# EAGLE schematic BMS_Master (EAGLE 6.6.0)

## Sheet 1 of 6: Supply
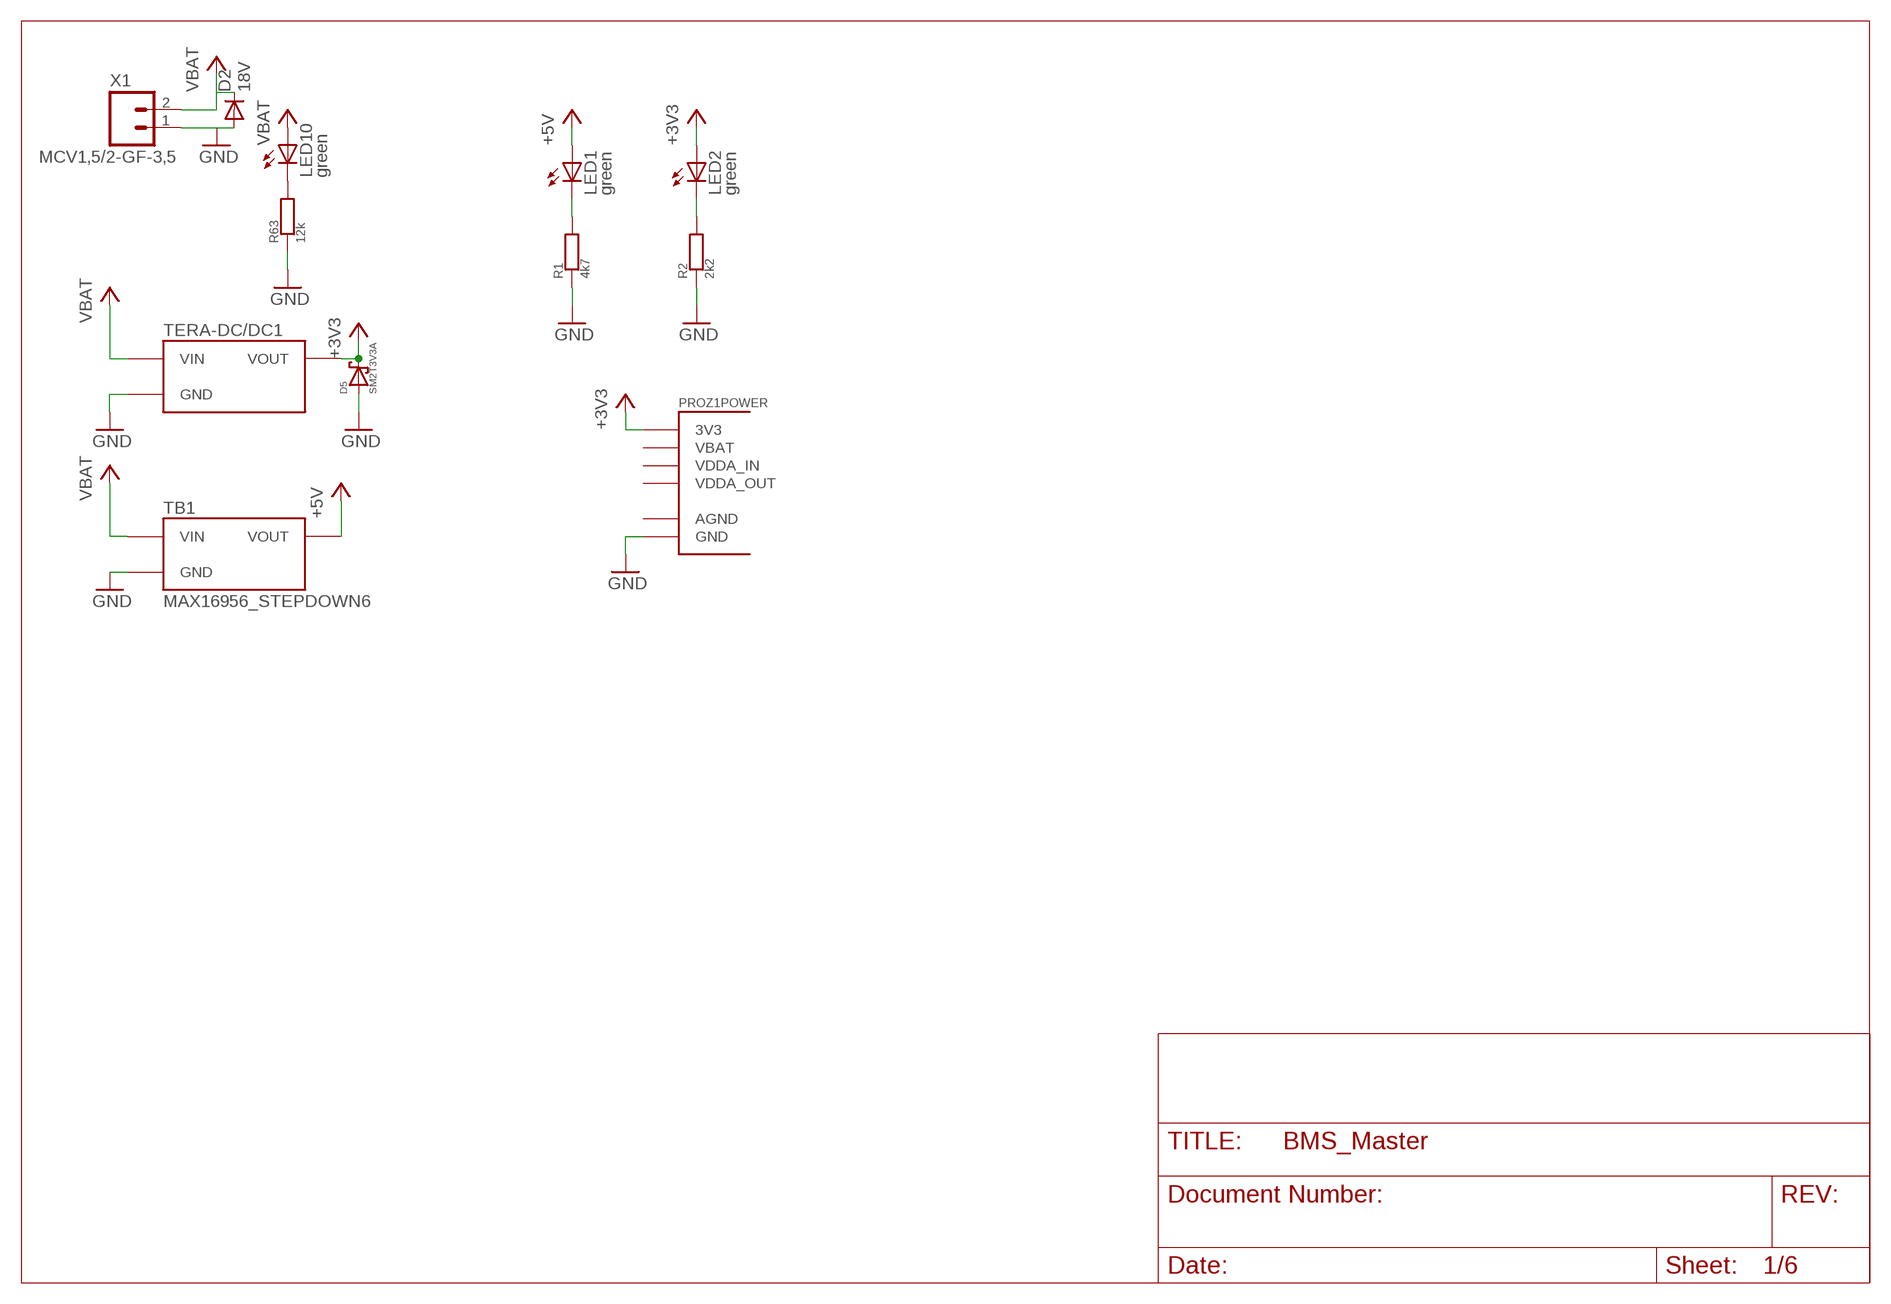
[diagram p0: schematic, sheet 1]

### Parts
D2  18V  DIODE-DO214AA  [DO214AA]
D5  SM2T3V3A  [SM2T3V3A]
LED1  green  LEDCHIP-LED0805  [CHIP-LED0805]
LED2  green  LEDCHIP-LED0805  [CHIP-LED0805]
LED10  green  LEDCHIP-LED0805  [CHIP-LED0805]
PROZ1  STM32F4_PROZESSORBOARDRPZ  [STM32F4_PROZESSORBOARD]
R1  4k7  R  [R0805]
R2  2k2  R  [R0805]
R63  12k  R  [R0805]
TB1  MAX16956_STEPDOWN6  [MAX16956_STEPDOWN6]
TERA-DC/DC1  MAX5035_STEPDOWN3  [MAX5035_STEPDOWN3]
X1  MCV1,5/2-GF-3,5  [MCV1,5/2-GF-3,5]

### Nets
+3V3: D5.P$2 LED2.A PROZ1.45(POWER:3V3) PROZ1.46(POWER:3V3) TERA-DC/DC1.VOUT ; also sheet 2,3,4,6
+5V: LED1.A TB1.VOUT ; also sheet 3,4,5,6
GND: D2.A D5.P$1 D5.P$11 PROZ1.47(POWER:GND) PROZ1.48(POWER:GND) R1.1 R2.1 R63.1 TB1.GND TB1.GND2(GND) TERA-DC/DC1.GND@1(GND) TERA-DC/DC1.GND@2(GND) X1.1 ; also sheet 2,3,4,5,6
N$1: LED1.C R1.2
N$2: LED2.C R2.2
N$54: LED10.C R63.2
VBAT: D2.C LED10.A TB1.VIN TERA-DC/DC1.VIN X1.2 ; also sheet 3,4,5,6
Unconnected: PROZ1.1(POWER:AGND) PROZ1.2(POWER:VDDA_IN) PROZ1.4(POWER:VDDA_OUT) PROZ1.6(POWER:VBAT)

## Sheet 2 of 6: Processor Interface
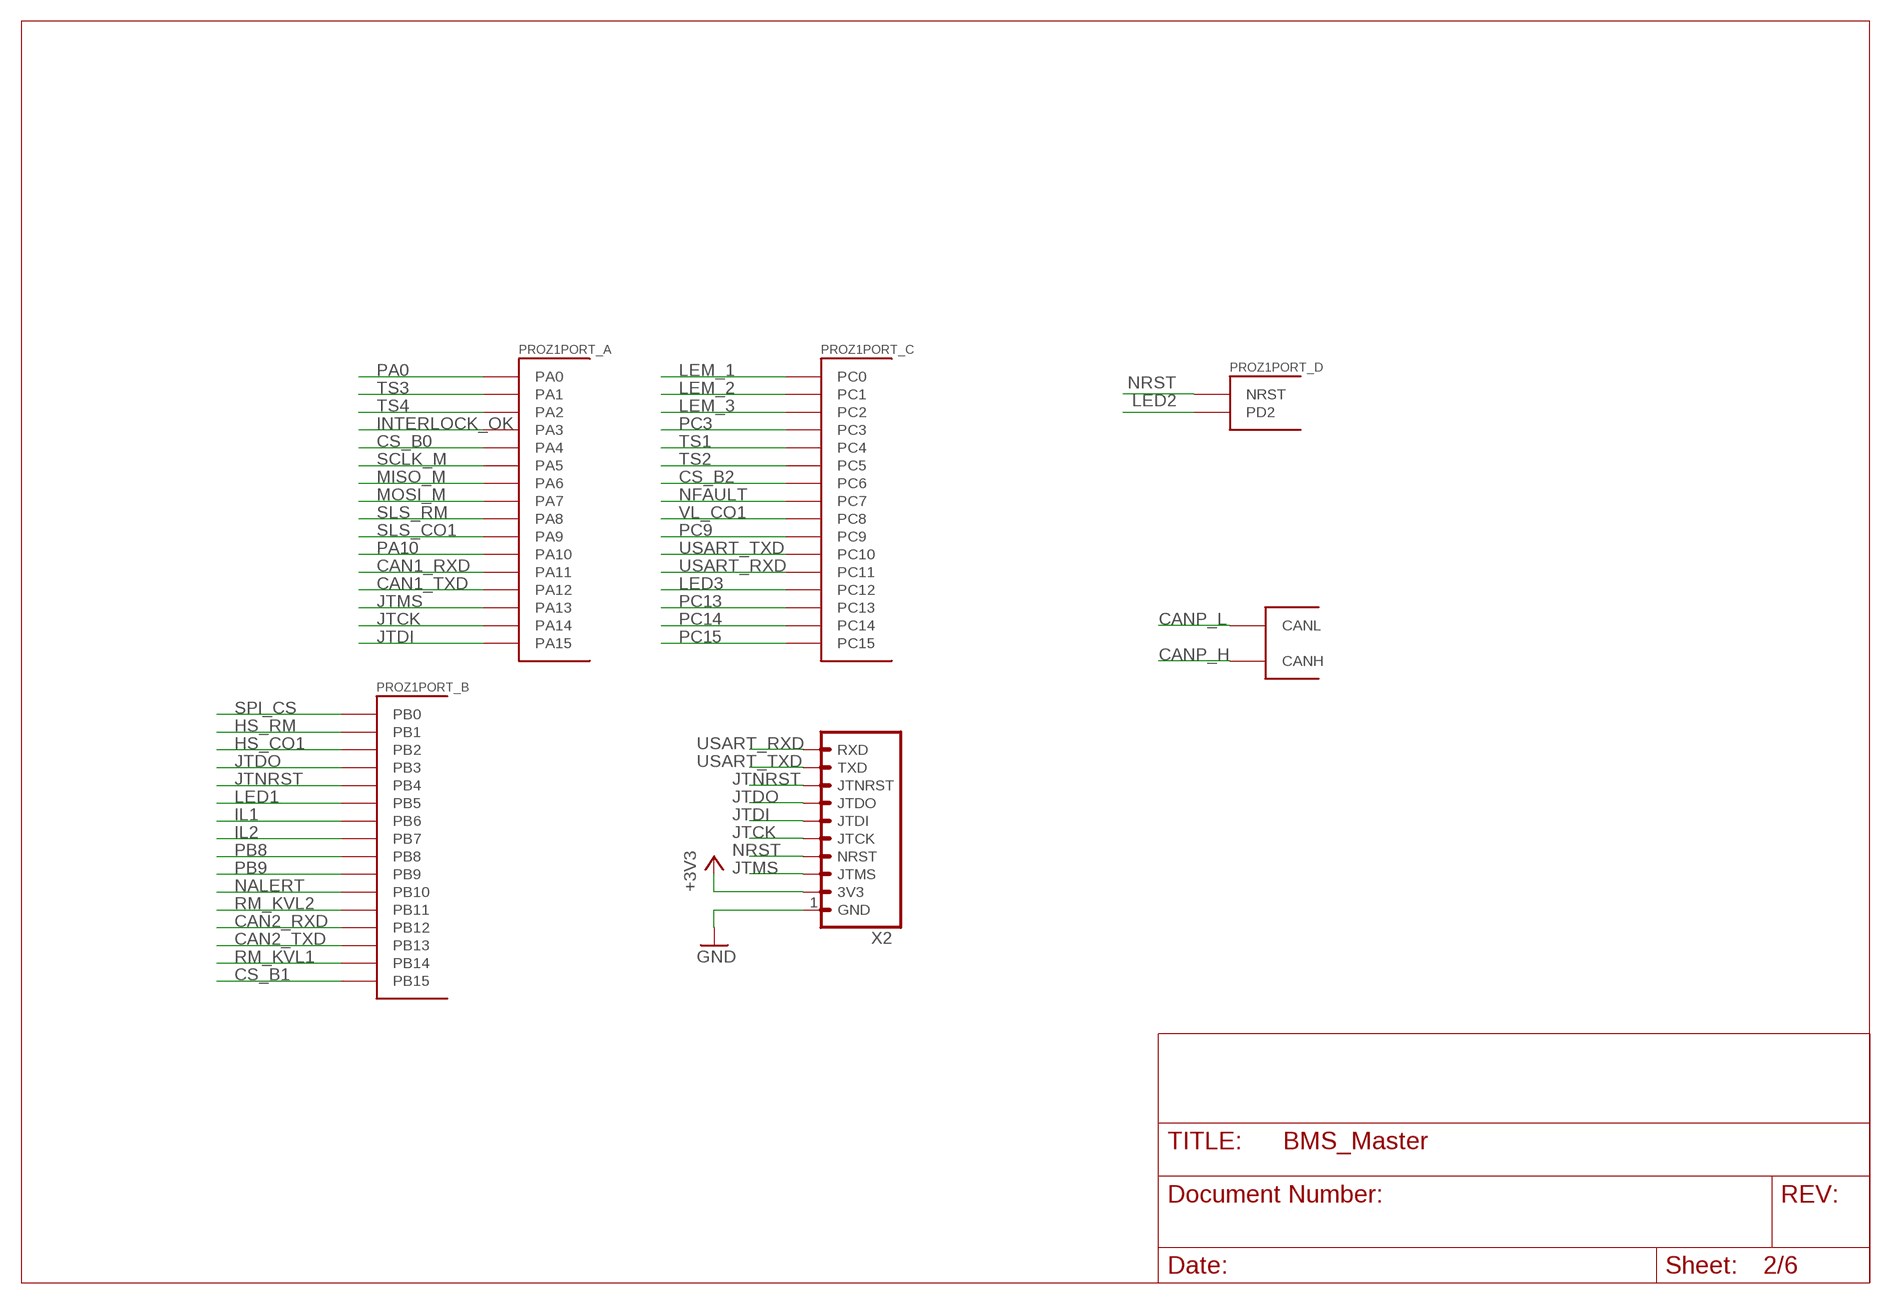
[diagram p1: schematic, sheet 2]

### Parts
X2  TERA-PROG-DEBUG-10GERADE  [90130-1110]

### Nets
+3V3: X2.2(3V3) ; also sheet 1,3,4,6
CAN1_RXD: PROZ1.26(PORT_A:PA11) ; also sheet 3
CAN1_TXD: PROZ1.24(PORT_A:PA12) ; also sheet 3
CAN2_RXD: PROZ1.50(PORT_B:PB12) ; also sheet 3
CAN2_TXD: PROZ1.49(PORT_B:PB13) ; also sheet 3
CANP_H: PROZ1.31(CAN:CANH) ; also sheet 3
CANP_L: PROZ1.32(CAN:CANL) ; also sheet 3
CS_B0: PROZ1.43(PORT_A:PA4) ; also sheet 3
CS_B1: PROZ1.51(PORT_B:PB15) ; also sheet 3
CS_B2: PROZ1.52(PORT_C:PC6) ; also sheet 3
GND: X2.1(GND) ; also sheet 1,3,4,5,6
HS_CO1: PROZ1.36(PORT_B:PB2) ; also sheet 4
HS_RM: PROZ1.37(PORT_B:PB1) ; also sheet 4
IL1: PROZ1.14(PORT_B:PB6) ; also sheet 4
IL2: PROZ1.12(PORT_B:PB7) ; also sheet 4
INTERLOCK_OK: PROZ1.44(PORT_A:PA3) ; also sheet 4,6
JTCK: PROZ1.18(PORT_A:PA14) X2.5(JTCK)
JTDI: PROZ1.16(PORT_A:PA15) X2.6(JTDI)
JTDO: PROZ1.20(PORT_B:PB3) X2.7(JTDO)
JTMS: PROZ1.59(PORT_A:PA13) X2.3(JTMS)
JTNRST: PROZ1.22(PORT_B:PB4) X2.8(JTNRST)
LED1: PROZ1.25(PORT_B:PB5)
LED2: PROZ1.27(PORT_D:PD2)
LED3: PROZ1.29(PORT_C:PC12)
LEM_1: PROZ1.15(PORT_C:PC0) ; also sheet 5
LEM_2: PROZ1.13(PORT_C:PC1) ; also sheet 5
LEM_3: PROZ1.11(PORT_C:PC2) ; also sheet 5
MISO_M: PROZ1.42(PORT_A:PA6) ; also sheet 3
MOSI_M: PROZ1.41(PORT_A:PA7) ; also sheet 3
NALERT: PROZ1.35(PORT_B:PB10) ; also sheet 4
NFAULT: PROZ1.53(PORT_C:PC7) ; also sheet 4
NRST: PROZ1.17(PORT_D:NRST) X2.4(NRST)
PA0: PROZ1.7(PORT_A:PA0)
PA10: PROZ1.58(PORT_A:PA10)
PB8: PROZ1.10(PORT_B:PB8)
PB9: PROZ1.8(PORT_B:PB9)
PC3: PROZ1.9(PORT_C:PC3)
PC9: PROZ1.55(PORT_C:PC9)
PC13: PROZ1.23(PORT_C:PC13)
PC14: PROZ1.21(PORT_C:PC14)
PC15: PROZ1.19(PORT_C:PC15)
RM_KVL1: PROZ1.33(PORT_B:PB14) ; also sheet 6
RM_KVL2: PROZ1.34(PORT_B:PB11) ; also sheet 6
SCLK_M: PROZ1.60(PORT_A:PA5) ; also sheet 3
SLS_CO1: PROZ1.57(PORT_A:PA9) ; also sheet 4
SLS_RM: PROZ1.56(PORT_A:PA8) ; also sheet 4
SPI_CS: PROZ1.38(PORT_B:PB0) ; also sheet 3
TS1: PROZ1.40(PORT_C:PC4) ; also sheet 5
TS2: PROZ1.39(PORT_C:PC5) ; also sheet 5
TS3: PROZ1.5(PORT_A:PA1) ; also sheet 5
TS4: PROZ1.3(PORT_A:PA2) ; also sheet 5
USART_RXD: PROZ1.30(PORT_C:PC11) X2.10(RXD)
USART_TXD: PROZ1.28(PORT_C:PC10) X2.9(TXD)
VL_CO1: PROZ1.54(PORT_C:PC8) ; also sheet 6

## Sheet 3 of 6: Bus Systems (CAN, SPI)
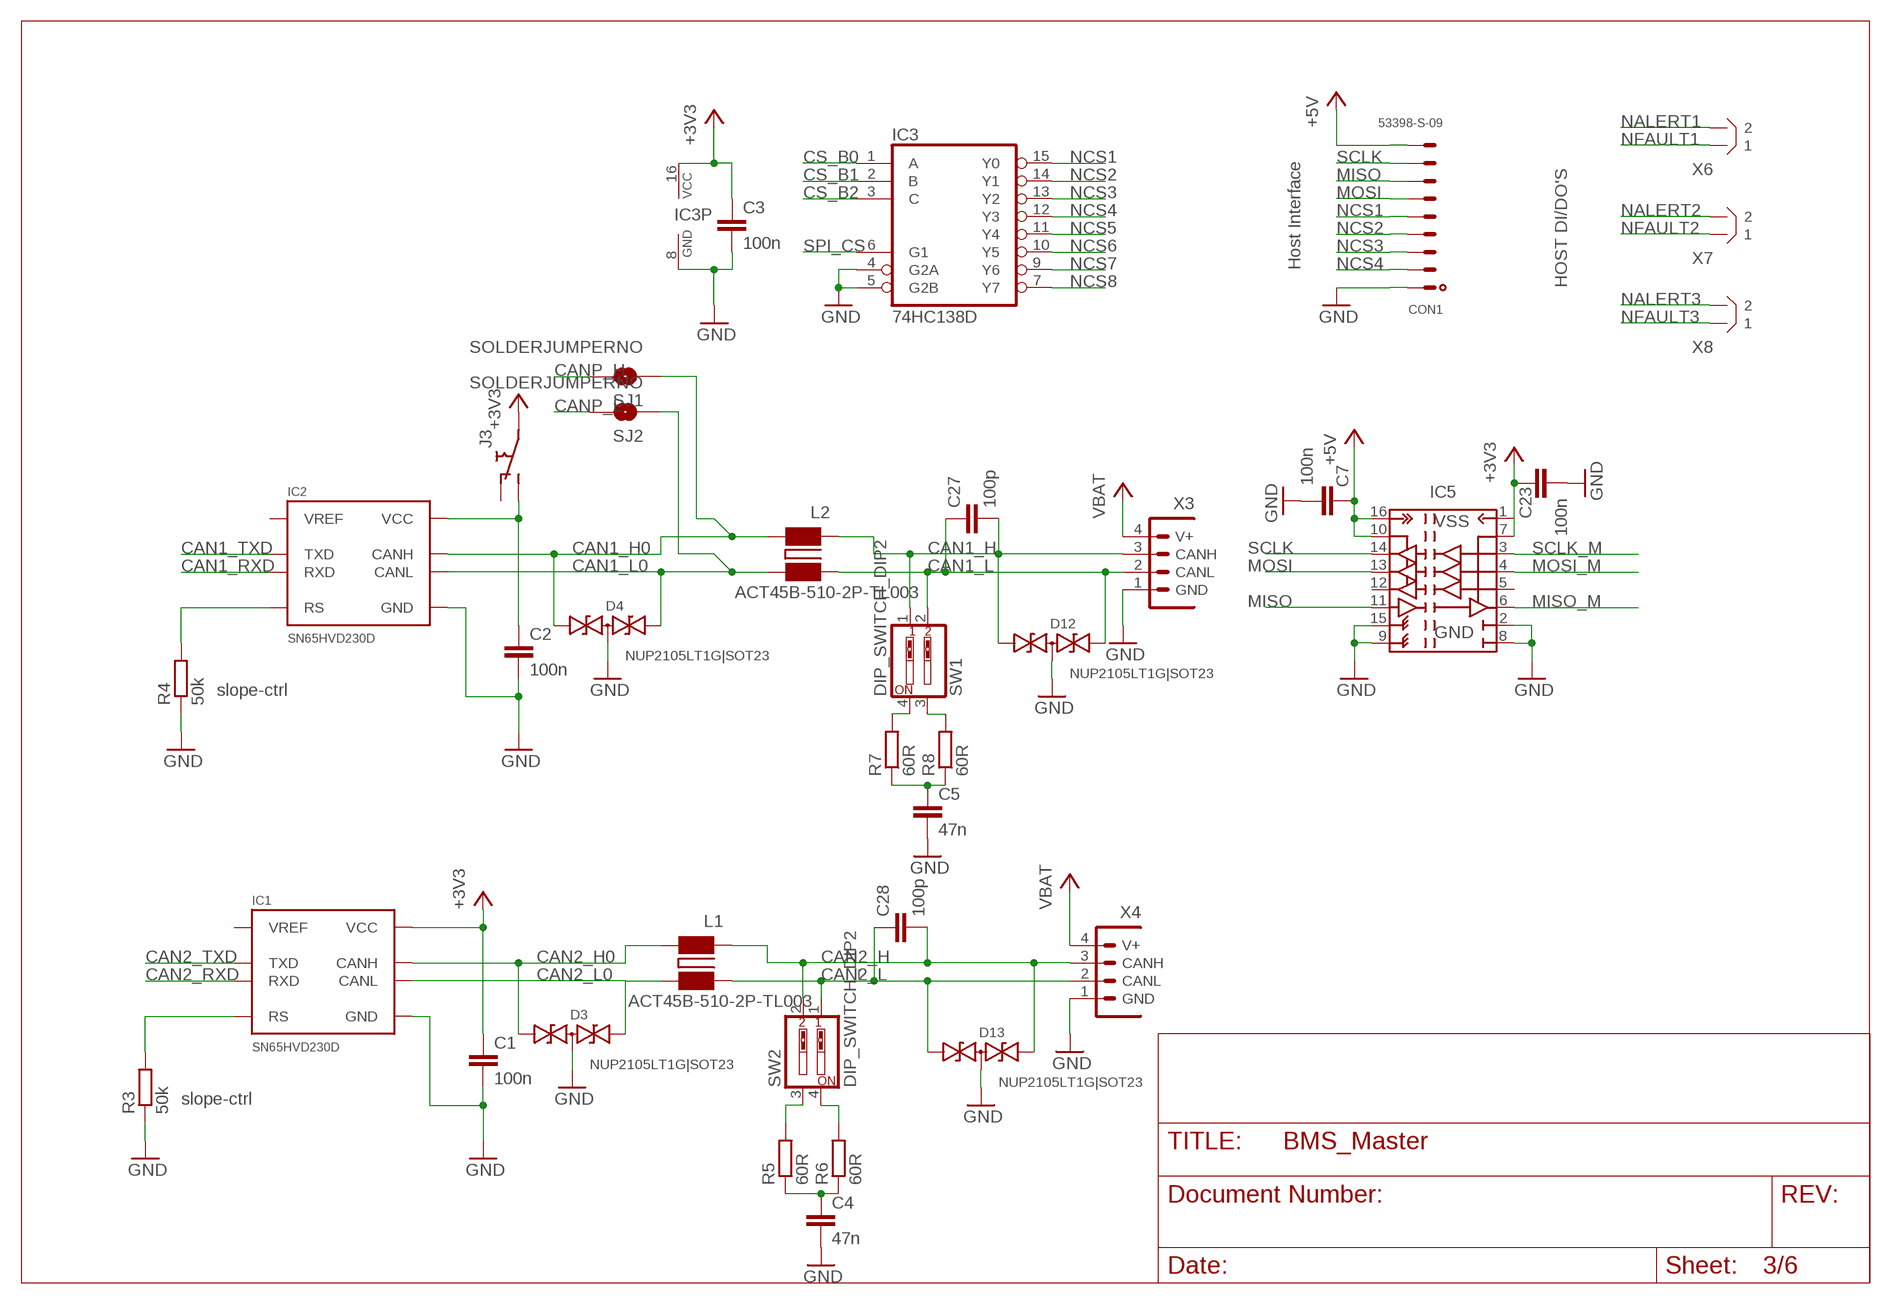
[diagram p2: schematic, sheet 3]

### Parts
C1  100n  C-EUC0805  [C0805]
C2  100n  C-EUC0805  [C0805]
C3  100n  C-EUC0805  [C0805]
C4  47n  C-EUC0603  [C0603]
C5  47n  C-EUC0603  [C0603]
C7  100n  C0603  [C0603]
C23  100n  C0603  [C0603]
C27  100p  C-EUC0603  [C0603]
C28  100p  C-EUC0603  [C0603]
CON1  53398-S-09  [53398-09-S]
D3  NUP2105LT1G|SOT23  [SOT23]
D4  NUP2105LT1G|SOT23  [SOT23]
D12  NUP2105LT1G|SOT23  [SOT23]
D13  NUP2105LT1G|SOT23  [SOT23]
IC1  SN65HVD230D  [SO08]
IC2  SN65HVD230D  [SO08]
IC3  74HC138D  [SO16]
IC5  ISO7241  [R-PDSO-G16]
J3  JUMPER_SWITCHS  [J_OR_S]
L1  ACT45B-510-2P-TL003  [ACT45B]
L2  ACT45B-510-2P-TL003  [ACT45B]
R3  50k  R-EU_R0805  [R0805]
R4  50k  R-EU_R0805  [R0805]
R5  60R  R-EU_R0603  [R0603]
R6  60R  R-EU_R0603  [R0603]
R7  60R  R-EU_R0603  [R0603]
R8  60R  R-EU_R0603  [R0603]
SJ1  SOLDERJUMPERNO  [SJ_2S-NO]
SJ2  SOLDERJUMPERNO  [SJ_2S-NO]
SW1  DIP_SWITCH_DIP2  [DIPSWITCH-02]
SW2  DIP_SWITCH_DIP2  [DIPSWITCH-02]
X3  CIOC_4-1-FV-A_CAN-BELEGUNG  [CIOC_4-1-FV]
X4  CIOC_4-1-FV-A_CAN-BELEGUNG  [CIOC_4-1-FV]
X6  B2B-XH  [B2B-XH]
X7  B2B-XH  [B2B-XH]
X8  B2B-XH  [B2B-XH]

### Nets
+3V3: C1.1 C3.1 C23.2 IC1.3(VCC) IC3.16(VCC) IC5.1(VCC1) IC5.7(EN1) J3.P$1 ; also sheet 1,2,4,6
+5V: C7.2 CON1.9 IC5.10(EN2) IC5.16(VCC2) ; also sheet 1,4,5,6
CAN1_H: C27.2 D12.1 L2.P$3 SW1.1 X3.3(CANH)
CAN1_H0: D4.1 IC2.7(CANH) L2.P$4 SJ1.1
CAN1_L: C27.1 D12.2 L2.P$1 SW1.2 X3.2(CANL)
CAN1_L0: D4.2 IC2.6(CANL) L2.P$2 SJ2.1
CAN1_RXD: IC2.4(RXD) ; also sheet 2
CAN1_TXD: IC2.1(TXD) ; also sheet 2
CAN2_H: C28.2 D13.2 L1.P$3 SW2.2 X4.3(CANH)
CAN2_H0: D3.1 IC1.7(CANH) L1.P$4
CAN2_L: C28.1 D13.1 L1.P$1 SW2.1 X4.2(CANL)
CAN2_L0: D3.2 IC1.6(CANL) L1.P$2
CAN2_RXD: IC1.4(RXD) ; also sheet 2
CAN2_TXD: IC1.1(TXD) ; also sheet 2
CANP_H: SJ1.2 ; also sheet 2
CANP_L: SJ2.2 ; also sheet 2
CS_B0: IC3.1(A) ; also sheet 2
CS_B1: IC3.2(B) ; also sheet 2
CS_B2: IC3.3(C) ; also sheet 2
GND: C1.2 C2.2 C3.2 C4.2 C5.2 C7.1 C23.1 CON1.1 D3.3 D4.3 D12.3 D13.3 IC1.2(GND) IC2.2(GND) IC3.4(G2A) IC3.5(G2B) IC3.8(GND) IC5.2(GND11) IC5.8(GND12) IC5.9(GND22) IC5.15(GND21) R3.1 R4.1 X3.1(GND) X4.1(GND) ; also sheet 1,2,4,5,6
MISO: CON1.7 IC5.11(IN_D) ; also sheet 4,6
MISO_M: IC5.6(OUT_D) ; also sheet 2
MOSI: CON1.6 IC5.13(OUT_B) ; also sheet 4,6
MOSI_M: IC5.4(IN_B) ; also sheet 2
N$3: C5.1 R7.1 R8.1
N$15: C2.1 IC2.3(VCC) J3.P$2
N$17: IC2.8(RS) R4.2
N$18: C4.1 R5.1 R6.1
N$19: R7.2 SW1.4
N$20: IC1.8(RS) R3.2
N$21: R5.2 SW2.3
N$23: R6.2 SW2.4
N$34: R8.2 SW1.3
NALERT1: X6.P$2 ; also sheet 4
NALERT2: X7.P$2 ; also sheet 4
NALERT3: X8.P$2 ; also sheet 4
NCS1: CON1.5 IC3.15(Y0)
NCS2: CON1.4 IC3.14(Y1)
NCS3: CON1.3 IC3.13(Y2)
NCS4: CON1.2 IC3.12(Y3)
NCS5: IC3.11(Y4)
NCS6: IC3.10(Y5) ; also sheet 4
NCS7: IC3.9(Y6) ; also sheet 4
NCS8: IC3.7(Y7) ; also sheet 6
NFAULT1: X6.P$1 ; also sheet 4
NFAULT2: X7.P$1 ; also sheet 4
NFAULT3: X8.P$1 ; also sheet 4
SCLK: CON1.8 IC5.14(OUT_A) ; also sheet 4,6
SCLK_M: IC5.3(IN_A) ; also sheet 2
SPI_CS: IC3.6(G1) ; also sheet 2
VBAT: X3.4(V+) X4.4(V+) ; also sheet 1,4,5,6
Unconnected: IC1.5(VREF) IC2.5(VREF) IC5.5(IN_C) IC5.12(OUT_C) J3.P$3

### Notes on the sheet
- Host Interface
- HOST DI/DO'S
- slope-ctrl
- slope-ctrl

## Sheet 4 of 6: Safety Systems
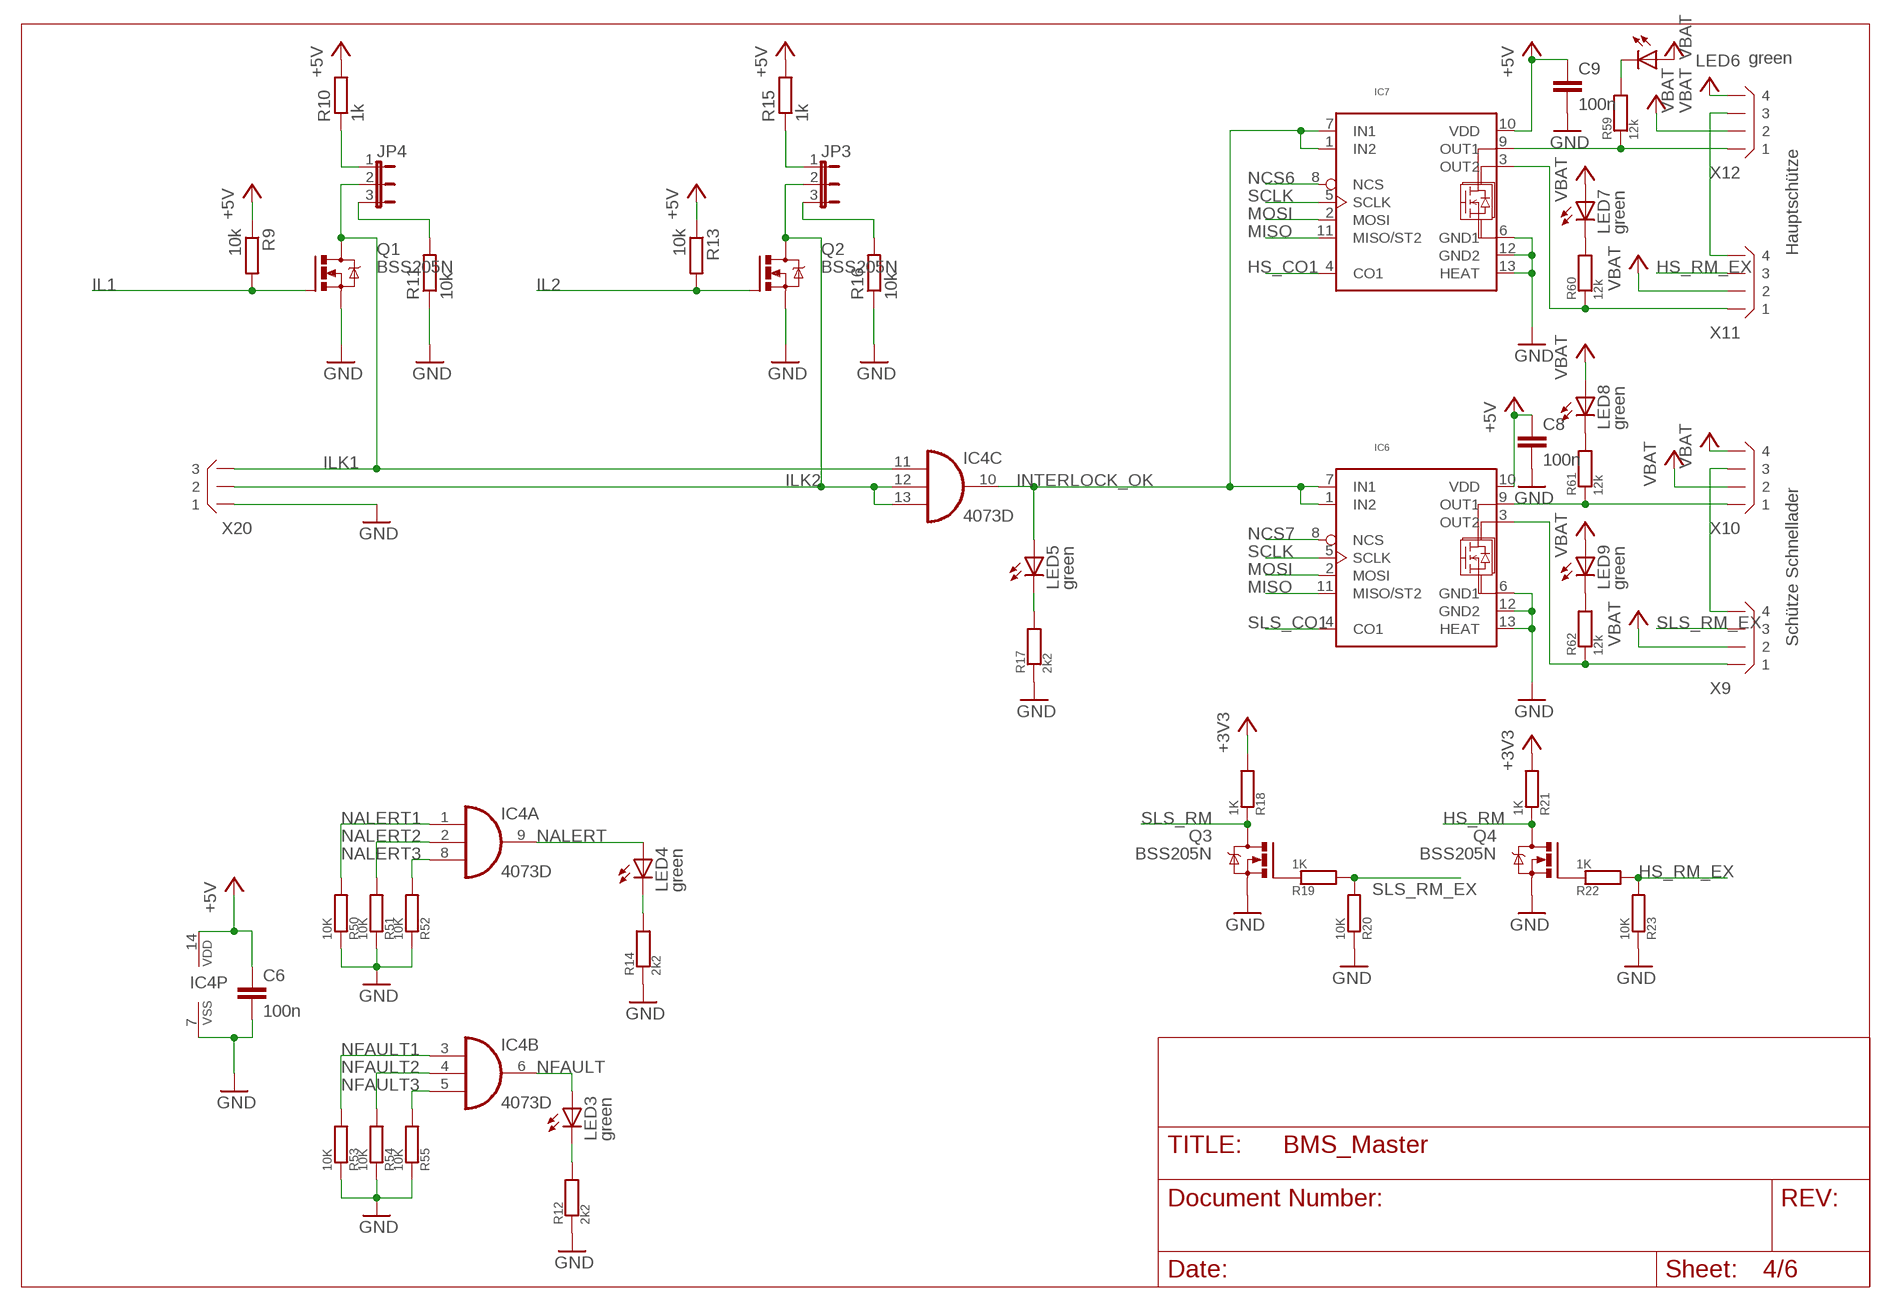
[diagram p3: schematic, sheet 4]

### Parts
C6  100n  C-EUC0603  [C0603]
C8  100n  C-EUC0603  [C0603]
C9  100n  C-EUC0603  [C0603]
IC4  4073D  [SO14]
IC6  TLE8102SGN  [INF-PG-DSO-12-11_N_1PRIMARY]
IC7  TLE8102SGN  [INF-PG-DSO-12-11_N_1PRIMARY]
JP3  JUMPER_OR  [JP2_OCT]
JP4  JUMPER_OR  [JP2_OCT]
LED3  green  LEDCHIPLED_0805  [CHIPLED_0805]
LED4  green  LEDCHIPLED_0805  [CHIPLED_0805]
LED5  green  LEDCHIPLED_0805  [CHIPLED_0805]
LED6  green  LEDCHIP-LED0805  [CHIP-LED0805]
LED7  green  LEDCHIP-LED0805  [CHIP-LED0805]
LED8  green  LEDCHIP-LED0805  [CHIP-LED0805]
LED9  green  LEDCHIP-LED0805  [CHIP-LED0805]
Q1  BSS205N  [SOT23]
Q2  BSS205N  [SOT23]
Q3  BSS205N  [SOT23]
Q4  BSS205N  [SOT23]
R9  10k  R-EU_R0603  [R0603]
R10  1k  R-EU_R0603  [R0603]
R11  10k  R-EU_R0603  [R0603]
R12  2k2  R  [R0805]
R13  10k  R-EU_R0603  [R0603]
R14  2k2  R  [R0805]
R15  1k  R-EU_R0603  [R0603]
R16  10k  R-EU_R0603  [R0603]
R17  2k2  R  [R0805]
R18  1K  R0603  [R0603]
R19  1K  R  [R0805]
R20  10K  R  [R0805]
R21  1K  R0603  [R0603]
R22  1K  R  [R0805]
R23  10K  R  [R0805]
R50  10K  R0603  [R0603]
R51  10K  R0603  [R0603]
R52  10K  R0603  [R0603]
R53  10K  R0603  [R0603]
R54  10K  R0603  [R0603]
R55  10K  R0603  [R0603]
R59  12k  R  [R0805]
R60  12k  R  [R0805]
R61  12k  R  [R0805]
R62  12k  R  [R0805]
X9  B4B-XH  [B4B-XH]
X10  B4B-XH  [B4B-XH]
X11  B4B-XH  [B4B-XH]
X12  B4B-XH  [B4B-XH]
X20  B3B-XH  [B3B-XH]

### Nets
+3V3: R18.2 R21.2 ; also sheet 1,2,3,6
+5V: C6.1 C8.1 C9.1 IC4.14(P:VDD) IC6.10(VDD) IC7.10(VDD) R9.1 R10.2 R13.1 R15.2 ; also sheet 1,3,5,6
GND: C6.2 C8.2 C9.2 IC4.7(P:VSS) IC6.6(GND1) IC6.12(GND2) IC6.13(HEAT) IC7.6(GND1) IC7.12(GND2) IC7.13(HEAT) Q1.2(S) Q2.2(S) Q3.2(S) Q4.2(S) R11.1 R12.1 R14.1 R16.1 R17.1 R20.1 R23.1 R50.1 R51.1 R52.1 R53.1 R54.1 R55.1 X20.P$1 ; also sheet 1,2,3,5,6
HS_CO1: IC7.4(CO1) ; also sheet 2
HS_RM: Q4.3(D) R21.1 ; also sheet 2
HS_RM_EX: R22.2 R23.2 X11.P$3
IL1: Q1.1(G) R9.2 ; also sheet 2
IL2: Q2.1(G) R13.2 ; also sheet 2
ILK1: IC4.11(C:I0) JP4.2 Q1.3(D) X20.P$3
ILK2: IC4.12(C:I1) IC4.13(C:I2) JP3.2 Q2.3(D) X20.P$2
INTERLOCK_OK: IC4.10(C:O) IC6.1(IN2) IC6.7(IN1) IC7.1(IN2) IC7.7(IN1) LED5.A ; also sheet 2,6
MISO: IC6.11(MISO/ST2) IC7.11(MISO/ST2) ; also sheet 3,6
MOSI: IC6.2(MOSI) IC7.2(MOSI) ; also sheet 3,6
N$5: X9.P$4 X10.P$3
N$6: IC7.3(OUT2) R60.1 X11.P$1
N$10: IC6.9(OUT1) R61.1 X10.P$1
N$11: X11.P$4 X12.P$3
N$12: IC6.3(OUT2) R62.1 X9.P$1
N$13: IC7.9(OUT1) R59.1 X12.P$1
N$14: JP4.1 R10.1
N$24: JP3.1 R15.1
N$26: JP3.3 R16.2
N$27: JP4.3 R11.2
N$28: LED5.C R17.2
N$29: LED4.C R14.2
N$30: LED3.C R12.2
N$36: Q3.1(G) R19.1
N$37: Q4.1(G) R22.1
N$46: LED6.C R59.2
N$47: LED7.C R60.2
N$48: LED8.C R61.2
N$49: LED9.C R62.2
NALERT: IC4.9(A:O) LED4.A ; also sheet 2
NALERT1: IC4.1(A:I0) R50.2 ; also sheet 3
NALERT2: IC4.2(A:I1) R51.2 ; also sheet 3
NALERT3: IC4.8(A:I2) R52.2 ; also sheet 3
NCS6: IC7.8(NCS) ; also sheet 3
NCS7: IC6.8(NCS) ; also sheet 3
NFAULT: IC4.6(B:O) LED3.A ; also sheet 2
NFAULT1: IC4.3(B:I0) R53.2 ; also sheet 3
NFAULT2: IC4.4(B:I1) R54.2 ; also sheet 3
NFAULT3: IC4.5(B:I2) R55.2 ; also sheet 3
SCLK: IC6.5(SCLK) IC7.5(SCLK) ; also sheet 3,6
SLS_CO1: IC6.4(CO1) ; also sheet 2
SLS_RM: Q3.3(D) R18.1 ; also sheet 2
SLS_RM_EX: R19.2 R20.2 X9.P$3
VBAT: LED6.A LED7.A LED8.A LED9.A X9.P$2 X10.P$2 X10.P$4 X11.P$2 X12.P$2 X12.P$4 ; also sheet 1,3,5,6

### Notes on the sheet
- Hauptschütze
- Schütze Schnellader

## Sheet 5 of 6: Analog: - Current Measurment - Charger Temperatur
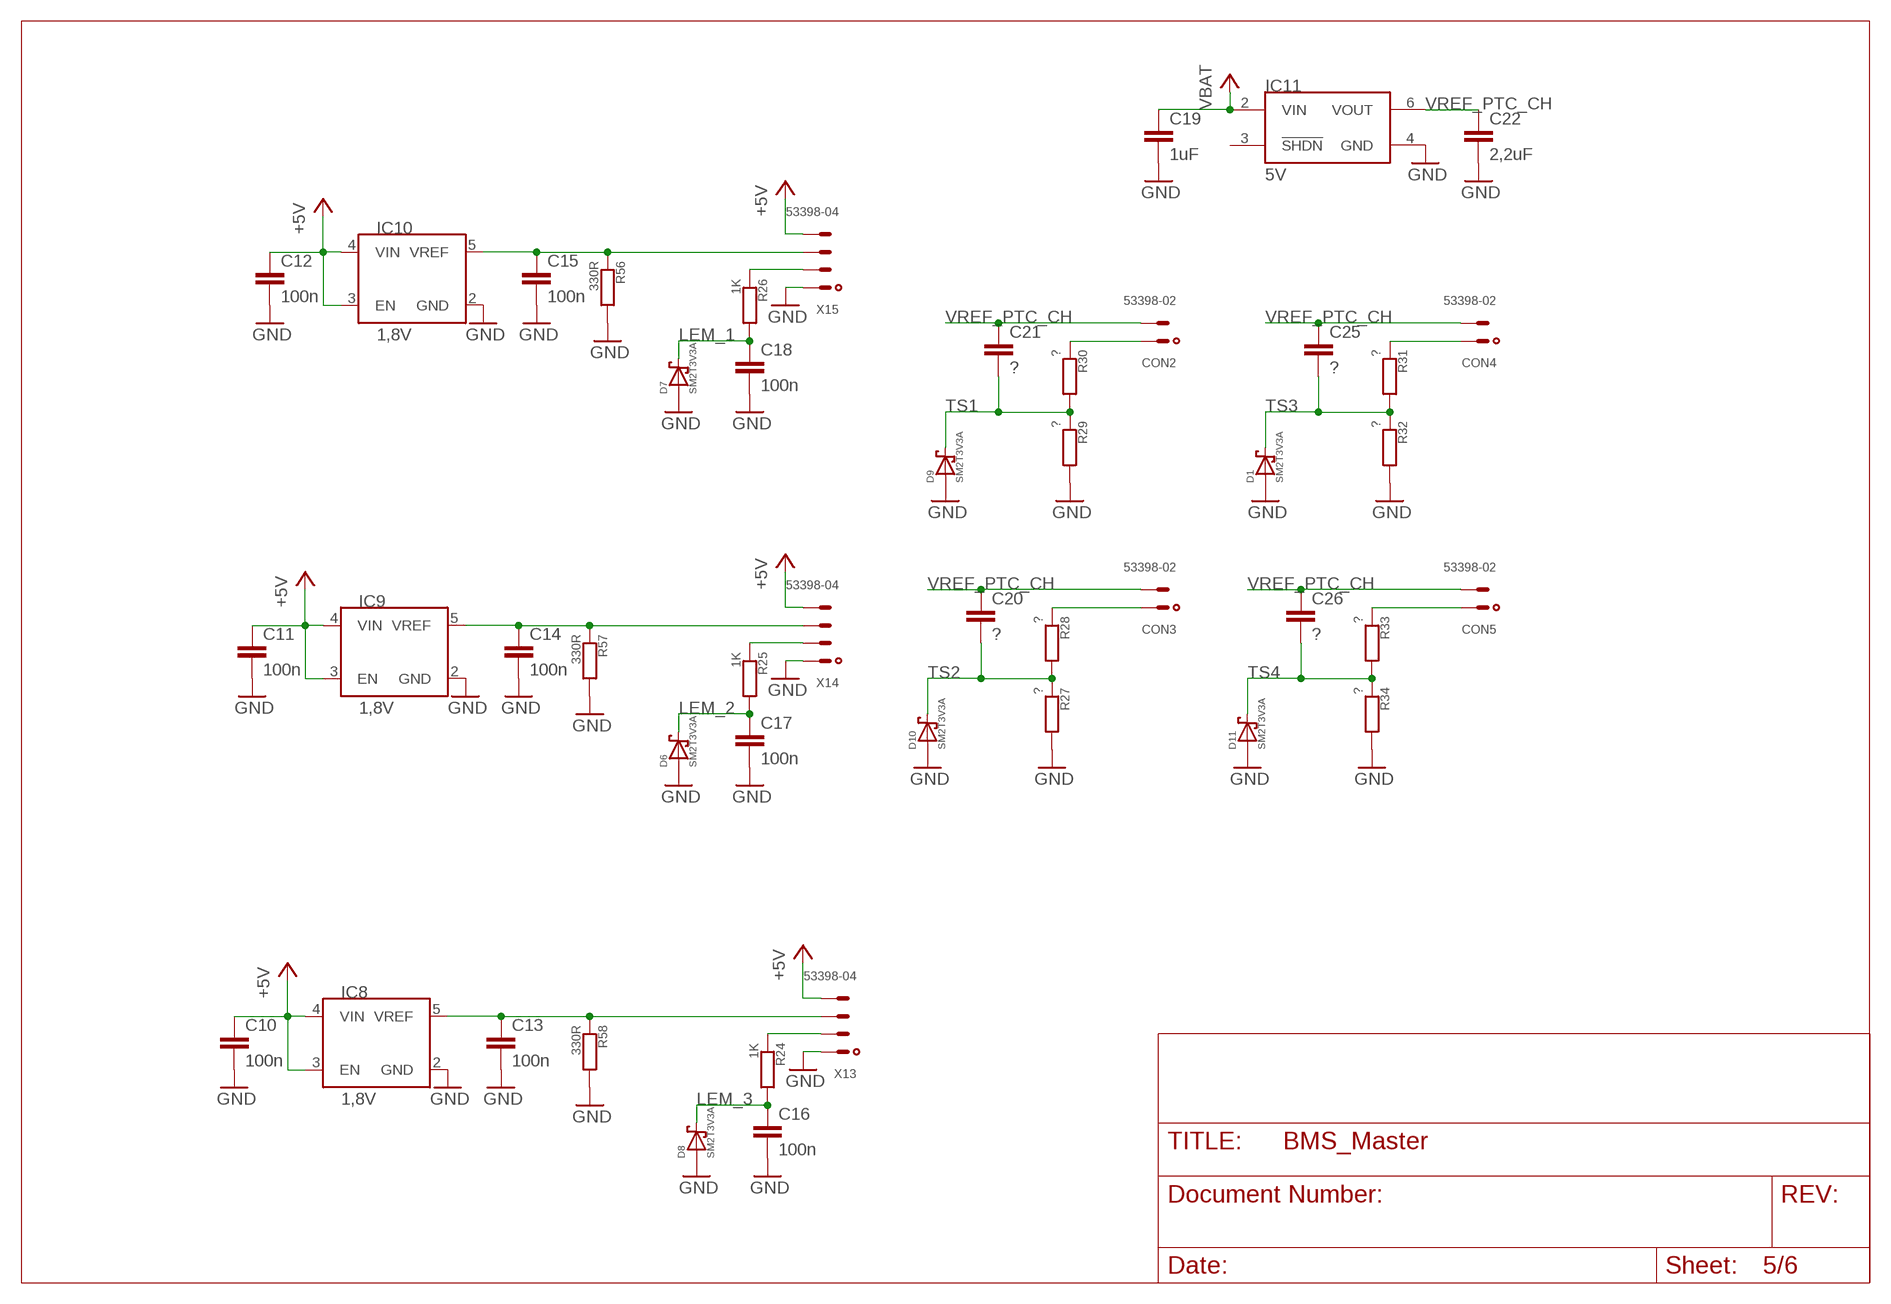
[diagram p4: schematic, sheet 5]

### Parts
C10  100n  C-EUC0805  [C0805]
C11  100n  C-EUC0805  [C0805]
C12  100n  C-EUC0805  [C0805]
C13  100n  C-EUC0805  [C0805]
C14  100n  C-EUC0805  [C0805]
C15  100n  C-EUC0805  [C0805]
C16  100n  C-EUC0805  [C0805]
C17  100n  C-EUC0805  [C0805]
C18  100n  C-EUC0805  [C0805]
C19  1uF  C-EUC0805  [C0805]
C20  ?  C-EUC0603  [C0603]
C21  ?  C-EUC0603  [C0603]
C22  2,2uF  C-EUC0805  [C0805]
C25  ?  C-EUC0603  [C0603]
C26  ?  C-EUC0603  [C0603]
CON2  53398-02  [53398-02]
CON3  53398-02  [53398-02]
CON4  53398-02  [53398-02]
CON5  53398-02  [53398-02]
D1  SM2T3V3A  [SM2T3V3A]
D6  SM2T3V3A  [SM2T3V3A]
D7  SM2T3V3A  [SM2T3V3A]
D8  SM2T3V3A  [SM2T3V3A]
D9  SM2T3V3A  [SM2T3V3A]
D10  SM2T3V3A  [SM2T3V3A]
D11  SM2T3V3A  [SM2T3V3A]
IC8  1,8V  LM4132L  [SOT23-5L]
IC9  1,8V  LM4132L  [SOT23-5L]
IC10  1,8V  LM4132L  [SOT23-5L]
IC11  5V  LT1461  [SO08]
R24  1K  R  [R0805]
R25  1K  R  [R0805]
R26  1K  R  [R0805]
R27  ?  R0603  [R0603]
R28  ?  R0603  [R0603]
R29  ?  R0603  [R0603]
R30  ?  R0603  [R0603]
R31  ?  R0603  [R0603]
R32  ?  R0603  [R0603]
R33  ?  R0603  [R0603]
R34  ?  R0603  [R0603]
R56  330R  R  [R0805]
R57  330R  R  [R0805]
R58  330R  R  [R0805]
X13  53398-04  [53398-04]
X14  53398-04  [53398-04]
X15  53398-04  [53398-04]

### Nets
+5V: C10.1 C11.1 C12.1 IC8.3(EN) IC8.4(VIN) IC9.3(EN) IC9.4(VIN) IC10.3(EN) IC10.4(VIN) X13.4 X14.4 X15.4 ; also sheet 1,3,4,6
GND: C10.2 C11.2 C12.2 C13.2 C14.2 C15.2 C16.2 C17.2 C18.2 C19.2 C22.2 D1.P$1 D1.P$11 D6.P$1 D6.P$11 D7.P$1 D7.P$11 D8.P$1 D8.P$11 D9.P$1 D9.P$11 D10.P$1 D10.P$11 D11.P$1 D11.P$11 IC8.2(GND) IC9.2(GND) IC10.2(GND) IC11.4(GND) R27.2 R29.2 R32.2 R34.2 R56.2 R57.2 R58.2 X13.1 X14.1 X15.1 ; also sheet 1,2,3,4,6
LEM_1: C18.1 D7.P$2 R26.2 ; also sheet 2
LEM_2: C17.1 D6.P$2 R25.2 ; also sheet 2
LEM_3: C16.1 D8.P$2 R24.2 ; also sheet 2
N$4: C13.1 IC8.5(VREF) R58.1 X13.3
N$7: R26.1 X15.2
N$9: C14.1 IC9.5(VREF) R57.1 X14.3
N$16: CON4.1 R31.1
N$22: CON5.1 R33.1
N$25: CON2.1 R30.1
N$31: R25.1 X14.2
N$32: C15.1 IC10.5(VREF) R56.1 X15.3
N$33: R24.1 X13.2
N$35: CON3.1 R28.1
TS1: C21.2 D9.P$2 R29.1 R30.2 ; also sheet 2
TS2: C20.2 D10.P$2 R27.1 R28.2 ; also sheet 2
TS3: C25.2 D1.P$2 R31.2 R32.1 ; also sheet 2
TS4: C26.2 D11.P$2 R33.2 R34.1 ; also sheet 2
VBAT: C19.1 IC11.2(VIN) ; also sheet 1,3,4,6
VREF_PTC_CH: C20.1 C21.1 C22.1 C25.1 C26.1 CON2.2 CON3.2 CON4.2 CON5.2 IC11.6(VOUT)
Unconnected: IC11.3(!SHDN)

## Sheet 6 of 6: Vorlade schütze
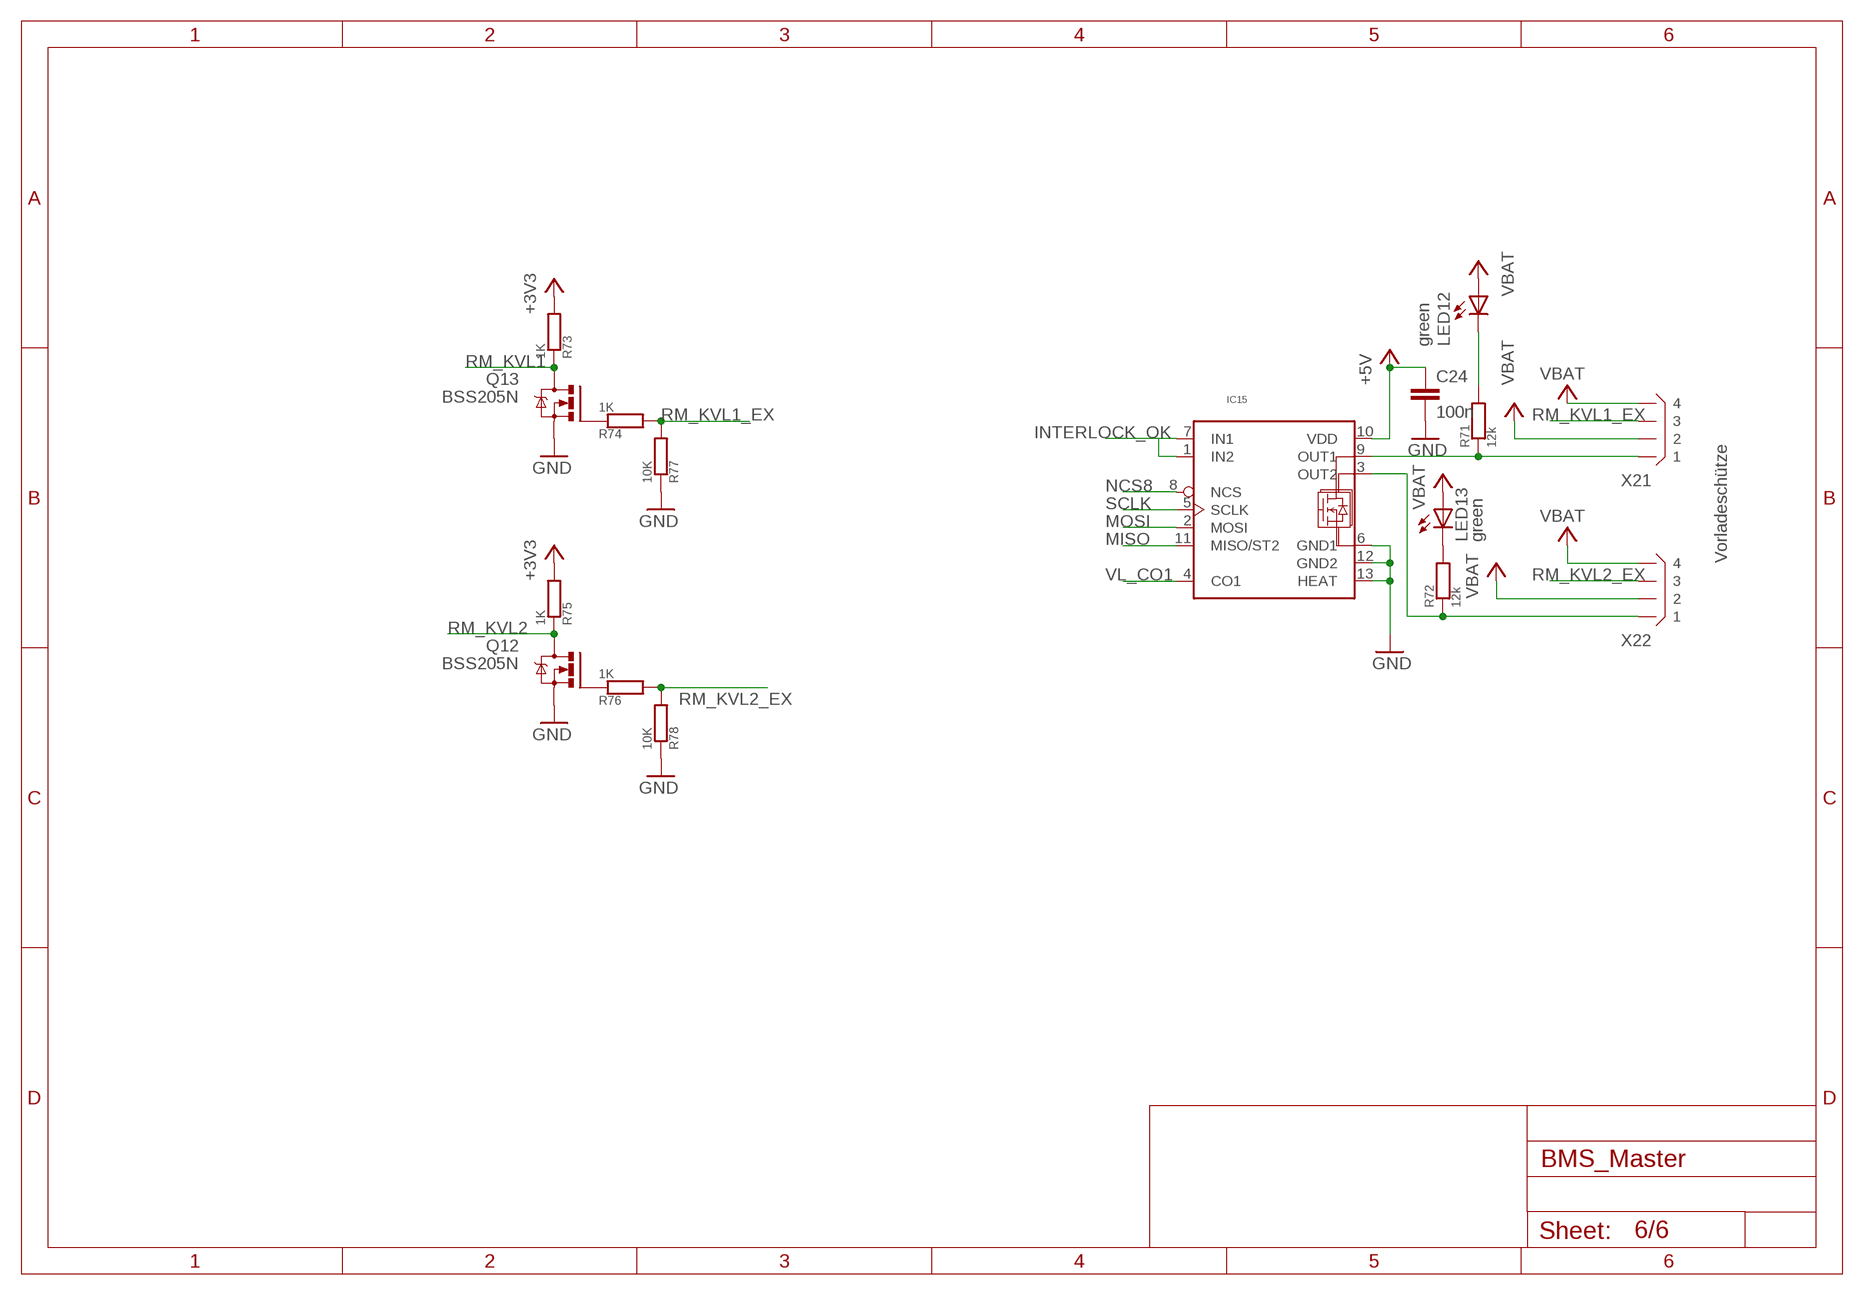
[diagram p5: schematic, sheet 6]

### Parts
C24  100n  C-EUC0603  [C0603]
IC15  TLE8102SGN  [INF-PG-DSO-12-11_N_1PRIMARY]
LED12  green  LEDCHIP-LED0805  [CHIP-LED0805]
LED13  green  LEDCHIP-LED0805  [CHIP-LED0805]
Q12  BSS205N  [SOT23]
Q13  BSS205N  [SOT23]
R71  12k  R  [R0805]
R72  12k  R  [R0805]
R73  1K  R  [R0805]
R74  1K  R  [R0805]
R75  1K  R  [R0805]
R76  1K  R  [R0805]
R77  10K  R  [R0805]
R78  10K  R  [R0805]
X21  B4B-XH  [B4B-XH]
X22  B4B-XH  [B4B-XH]

### Nets
+3V3: R73.2 R75.2 ; also sheet 1,2,3,4
+5V: C24.1 IC15.10(VDD) ; also sheet 1,3,4,5
GND: C24.2 IC15.6(GND1) IC15.12(GND2) IC15.13(HEAT) Q12.2(S) Q13.2(S) R77.1 R78.1 ; also sheet 1,2,3,4,5
INTERLOCK_OK: IC15.1(IN2) IC15.7(IN1) ; also sheet 2,4
MISO: IC15.11(MISO/ST2) ; also sheet 3,4
MOSI: IC15.2(MOSI) ; also sheet 3,4
N$59: IC15.3(OUT2) R72.1 X22.P$1
N$60: IC15.9(OUT1) R71.1 X21.P$1
N$61: LED12.C R71.2
N$62: LED13.C R72.2
N$63: Q12.1(G) R76.1
N$64: Q13.1(G) R74.1
NCS8: IC15.8(NCS) ; also sheet 3
RM_KVL1: Q13.3(D) R73.1 ; also sheet 2
RM_KVL1_EX: R74.2 R77.2 X21.P$3
RM_KVL2: Q12.3(D) R75.1 ; also sheet 2
RM_KVL2_EX: R76.2 R78.2 X22.P$3
SCLK: IC15.5(SCLK) ; also sheet 3,4
VBAT: LED12.A LED13.A X21.P$2 X21.P$4 X22.P$2 X22.P$4 ; also sheet 1,3,4,5
VL_CO1: IC15.4(CO1) ; also sheet 2

### Notes on the sheet
- Vorladeschütze

## Library data of the parts
C1-C6 C8-C22 C24-C28 = rcl:C-EU: CAPACITOR, European symbol
C7 C23 = useful:C
CON1 = con-molex:53?-09: CONNECTOR wire to board 1.25 mm (.049 inch) pitch header
CON2-CON5 = con-molex:53?-02: CONNECTOR wire to board 1.25 mm (.049 inch) pitch header
D1 D5-D11 = st:SM2T3V3A: ST2T3V3A Low voltage TransilTM
D2 = diode:DIODE-: DIODE
D3 D4 D12 D13 = diode:NUP2105LT1G: DIODE, CAN BUS Protector NUP2105LT1G
IC1 IC2 = ti:SN65HVD23*D: 3v3 powered CAN Transeiver by TI with Slope control and reference voltage; POWER_SLEEP_MODE: no
IC3 = 74xx-eu:74*138: 3-line to 8-line DECODER/DEMULTIPLEXER
IC4 = 40xx:4073: Triple 3-input AND
IC5 = ti:ISO7241
IC6 IC7 IC15 = infineon:TLE8102SG
IC8-IC10 = ti:LM4132
IC11 = linear:LT1461
J3 = jumper:JUMPER_SWITCH
JP3 JP4 = jumper:JUMPER_OR: JUMPER
L1 L2 = epcos:ACT45B-510-2P-TL003: Common mode choke SMD 51uH 200mA CAN bus; DISTR: RS-Components; ORDERNR: 774-0544
LED1-LED10 LED12 LED13 = led:LED: LED OSRAM: - CHIPLED LG R971, LG N971, LY N971, LG Q971, LY Q971, LO R971, LY R971 LH N974, LH R974 LS Q976, LO Q976, LY Q976 LO Q996 - Hyper CHIPLED LW Q18S LB Q993, LB Q99A, LB R99A - SideLED LS A670, LO A670, LY A670, LG A670, LP A670 LB A673, LV A673, LT A673, LW A673 LH A674 LY A675 LS A676, LA A676, LO A676, LY A676, LW A676 LS A679, LY A679, LG A679 - Hyper Micro SIDELED® LS Y876, LA Y876, LO Y876, LY Y876 LT Y87S - SmartLED LW L88C, LW L88S LB L89C, LB L89S, LG L890 LS L89K, LO L89K, LY L89K LS L896, LA L896, LO L896, LY L896 - TOPLED LS T670, LO T670, LY T670, LG T670, LP T670 LSG T670, LSP T670, LSY T670, LOP T670, LYG T670 LG T671, LOG T671, LSG T671 LB T673, LV T673, LT T673, LW T673 LH T674 LS T676, LA T676, LO T676, LY T676, LB T676, LH T676, LSB T676, LW T676 LB T67C, LV T67C, LT T67C, LS T67K, LO T67K, LY T67K, LW E67C LS E67B, LA E67B, LO E67B, LY E67B, LB E67C, LV E67C, LT E67C LW T67C LS T679, LY T679, LG T679 LS T770, LO T770, LY T770, LG T770, LP T770 LB T773, LV T773, LT T773, LW T773 LH T774 LS E675, LA E675, LY E675, LS T675 LS T776, LA T776, LO T776, LY T776, LB T776 LHGB T686 LT T68C, LB T68C - Hyper Mini TOPLED® LB M676 - Mini TOPLED Santana® LG M470 LS M47K, LO M47K, LY M47K Source: http://www.osram.convergy.de LUXEON: - LUMILED® LXK2-PW12-R00, LXK2-PW12-S00, LXK2-PW14-U00, LXK2-PW14-V00 LXK2-PM12-R00, LXK2-PM12-S00, LXK2-PM14-U00 LXK2-PE12-Q00, LXK2-PE12-R00, LXK2-PE12-S00, LXK2-PE14-T00, LXK2-PE14-U00 LXK2-PB12-K00, LXK2-PB12-L00, LXK2-PB12-M00, LXK2-PB14-N00, LXK2-PB14-P00, LXK2-PB14-Q00 LXK2-PR12-L00, LXK2-PR12-M00, LXK2-PR14-Q00, LXK2-PR14-R00 LXK2-PD12-Q00, LXK2-PD12-R00, LXK2-PD12-S00 LXK2-PH12-R00, LXK2-PH12-S00 LXK2-PL12-P00, LXK2-PL12-Q00, LXK2-PL12-R00 Source: www.luxeon.com KINGBRIGHT: KA-3528ASYC Source: www.kingbright.com
PROZ1 = tera-boards:STM32F4_PROZESSORBOARD
Q1-Q4 Q12 Q13 = infineon:BSS205N: Infineon Small Signal Transistor, OptiMOS 2 Technology, 20V, 2.5A SOT23
R1 R2 R12 R14 R17-R34 R50-R63 R71-R78 = useful:R
R3-R11 R13 R15 R16 = rcl:R-EU_: RESISTOR, European symbol
SJ1 SJ2 = useful:SOLDERJUMPER: Solder Jumper Standard SMD solder jumper. Used to automate production. Two varients : Normally Open and Normally Closed are the same, but have different paste layers. NC will have a large amount of paste and should jumper during reflow.
SW1 SW2 = te-electronics:DIP_SWITCH_DIP2: TE - 1825360-1 TE - 1825002-1
TB1 = tera-boards:MAX16956_STEPDOWN6
TERA-DC/DC1 = tera-boards:MAX5035_STEPDOWN3
X1 = con-phoenix:MCV1,5/2-GF-3,5
X2 = useful:TERA-PROG-DEBUG-10: TERA-Prog-Debug Connector 10-Pol
X3 X4 = con-phoenix:CIOC_4-1-FV-A_CAN-BELEGUNG: CIOC_4-1-FV-A mit Bezeichnungen für CAN-Signale und Versorgungen; MANUF: Phoenix-Contact; ORDERNR: 1701388
X6-X8 = con-jst-xh:?2B-XH
X9-X12 X21 X22 = con-jst-xh:?4B-XH
X13-X15 = con-molex:53?-04: CONNECTOR wire to board 1.25 mm (.049 inch) pitch header
X20 = con-jst-xh:?3B-XH